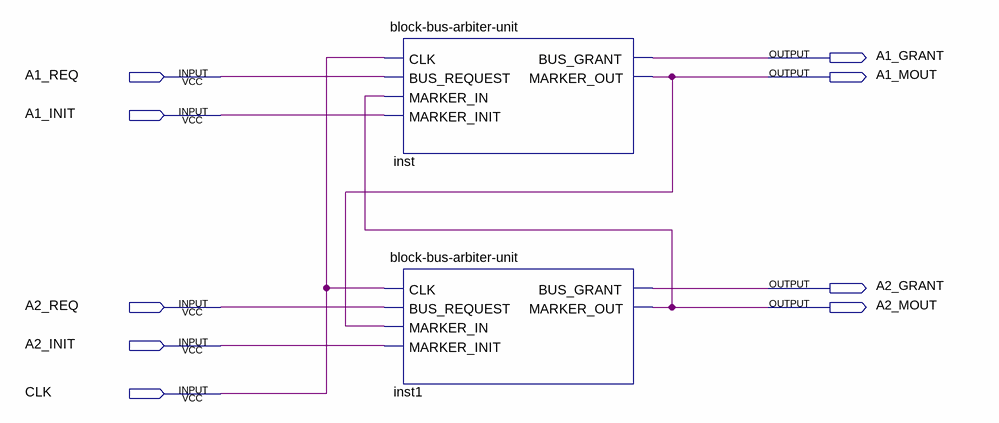
[diagram p0: schematic sheet]
// Quartus schematic test-block-bus-arbiter-unit.bdf as structural Verilog: 2 symbols, 9 pins
module \test-block-bus-arbiter-unit  (
  input  A1_REQ,
  input  A1_INIT,
  input  A2_REQ,
  input  A2_INIT,
  input  CLK,
  output A1_GRANT,
  output A1_MOUT,
  output A2_GRANT,
  output A2_MOUT
);

  \block-bus-arbiter-unit  inst (
    .CLK(CLK), .BUS_REQUEST(A1_REQ), .MARKER_IN(A2_MOUT), .MARKER_INIT(A1_INIT), .BUS_GRANT(A1_GRANT),
    .MARKER_OUT(A1_MOUT));
  \block-bus-arbiter-unit  inst1 (
    .CLK(CLK), .BUS_REQUEST(A2_REQ), .MARKER_IN(A1_MOUT), .MARKER_INIT(A2_INIT), .BUS_GRANT(A2_GRANT),
    .MARKER_OUT(A2_MOUT));
endmodule
